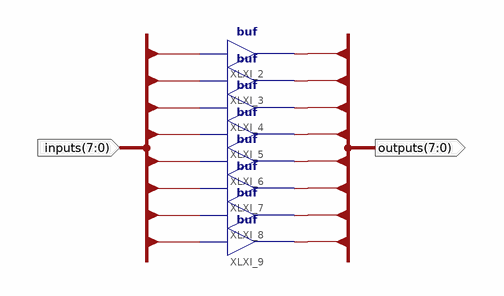
[diagram p0: schematic sheet 1]
// Xilinx ISE schematic buf8.sch (spartan6) as structural Verilog: 8 symbols, 2 ports
module buf8 (
  input  [7:0] inputs,
  output [7:0] outputs
);

  buf XLXI_2 (outputs[7], inputs[7]);
  buf XLXI_3 (outputs[6], inputs[6]);
  buf XLXI_4 (outputs[5], inputs[5]);
  buf XLXI_5 (outputs[4], inputs[4]);
  buf XLXI_6 (outputs[3], inputs[3]);
  buf XLXI_7 (outputs[2], inputs[2]);
  buf XLXI_8 (outputs[1], inputs[1]);
  buf XLXI_9 (outputs[0], inputs[0]);
endmodule
